# Altium schematic sheet 100046138_block_diagram.SchDoc
size 863 x 558 mm; SheetNumber: 1; SheetTotal: 4
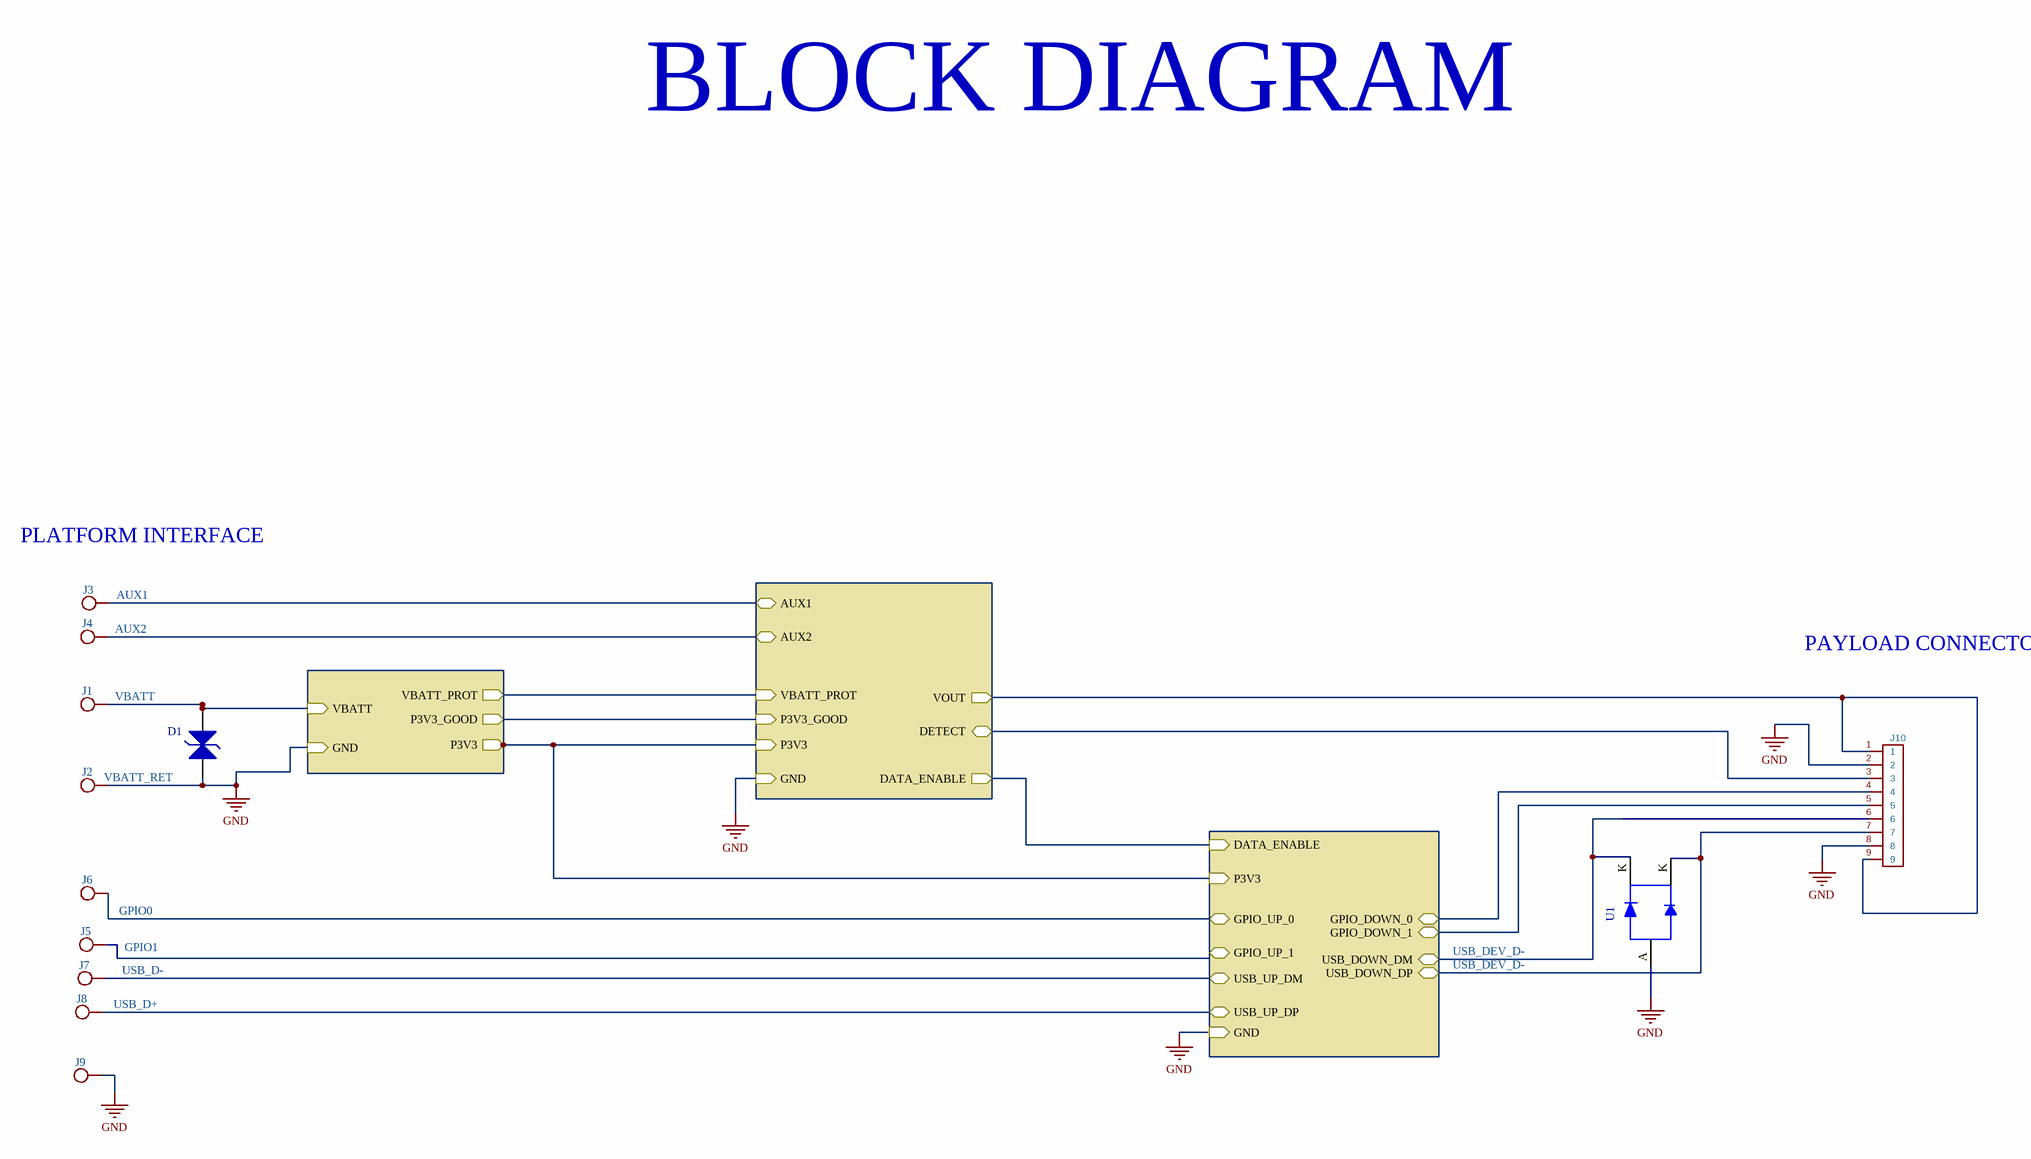
[diagram p0: 100046138_block_diagram.SchDoc]

## Parts
D1  SMF26A  [DI-SOD123F-A]  (value not drawn)
J1  ~  [PTH_18AWG]  (value not drawn)
J2  (no value)  [PTH_18AWG]
J3  (no value)  [PTH_24AWG_offset_rectangular]
J4  (no value)  [PTH_24AWG_offset_rectangular]
J5  (no value)  [PTH_24AWG_offset_rectangular]
J6  ~  [PTH_24AWG_offset_rectangular]  (value not drawn)
J7  ~  [PTH_24AWG_offset_rectangular]  (value not drawn)
J8  ~  [PTH_24AWG_offset_rectangular]  (value not drawn)
J9  ~  [PTH_24AWG_offset_rectangular]  (value not drawn)
J10  ~  [399-10-109-10-007000]  (value not drawn)
U1  PESD5V0C2UM  [IC-SOT883-2-B]  (value not drawn)

## Sub-sheets
Data Switches = 100046138_data_switches.SchDoc: GND (in), P3V3 (in), USB_DOWN_DP (bidir), USB_DOWN_DM (bidir), USB_UP_DP (bidir), USB_UP_DM (bidir), DATA_ENABLE (in), GPIO_DOWN_0 (bidir), GPIO_DOWN_1 (bidir), GPIO_UP_0 (bidir), GPIO_UP_1 (bidir)
Payload Power Control = 100046138_output_control.SchDoc: P3V3 (in), GND (in), VOUT (out), VBATT_PROT (in), AUX1 (bidir), AUX2 (bidir), P3V3_GOOD (in), DETECT (bidir), DATA_ENABLE (out)
Power Input = 100046138_power.SchDoc: VBATT (in), GND (in), P3V3 (out), VBATT_PROT (out), P3V3_GOOD (out)

## Nets
GND: D1.A J2.1 J9.1 J10.2 J10.8 U1.A ; sheet Payload Power Control/GND, sheet Power Input/GND
AUX1: J3.1 ; sheet Payload Power Control/AUX1
AUX2: J4.1 ; sheet Payload Power Control/AUX2
GPIO0: J6.1 ; sheet Data Switches/GPIO_UP_0
USB_D+: J8.1 ; sheet Data Switches/USB_UP_DP
USB_D-: J7.1 ; sheet Data Switches/USB_UP_DM
USB_DEV_D-: J10.6 J10.7 U1.K ; sheet Data Switches/USB_DOWN_DP, sheet Data Switches/USB_DOWN_DM
VBATT: D1.K J1.1 ; sheet Power Input/VBATT
NetJ10_1: J10.1 J10.9 ; sheet Payload Power Control/VOUT
NetJ10_3: J10.3 ; sheet Payload Power Control/DETECT
NetJ10_4: J10.4 ; sheet Data Switches/GPIO_DOWN_0
NetJ10_5: J10.5 ; sheet Data Switches/GPIO_DOWN_1
(unnamed): sheet Data Switches/P3V3, sheet Payload Power Control/P3V3, sheet Power Input/P3V3
(unnamed): sheet Data Switches/DATA_ENABLE, sheet Payload Power Control/DATA_ENABLE
(unnamed): sheet Payload Power Control/VBATT_PROT, sheet Power Input/VBATT_PROT
(unnamed): sheet Payload Power Control/P3V3_GOOD, sheet Power Input/P3V3_GOOD

Not connected (* = marked no-connect by the designer): J5 1

## Notes on the sheet
- BLOCK DIAGRAM
- PLATFORM INTERFACE
- PAYLOAD CONNECTOR
- Labels drawn without touching a wire or pin: GPIO1, VBATT_RET
- DWG NO
- REVISIONS
- SH
- REVISION
- DESCRIPTION
- DATE(YEAR-MO-DA)
- APPROVED
- THIS DRAWING IS CAD MAINTAINED.
  CHANGES SHALL BE INCORPORATED
  BY THE DESIGN ACTIVITY.
- PART NO.
- CONTRACT NUMBER
- DESIGN ACTIVITY
- CONTRACTOR
- US ARMY
  COMBAT CAPABILITIES DEVELOPMENT COMMAND ARMAMENTS CENTER
  PICATINNY ARSENAL, NEW JERSEY 07806-5000
- DRAWN BY
- ENGINEER
- CHECKER
- QUALITY ENGINEER
- DRAWING APPROVAL
- SIZE
- CAGE CODE
- DWG NO.
- NEXT ASSY
- USED ON
- DESIGN APPROVAL
- D
- 19200
- APPLICATION
- SCALE
- NONE
- UNIT WT.
- ---
- SHEET

## Library data of the parts
D1 = CMP-00657-1: SMF Series 200 W 26 V Uni-Directional Surface Mount TVS Diode - SOD-123F; Breakdown Voltage: 30.4V; Clamping Voltage: 42.1V; Max Breakdown Voltage: 31.9V; Max Power Dissipation: 1W; Max Reverse Leakage Current: 1µA; Max Surge Current: 4.8A; Min Breakdown Voltage: 28.9V; Number of Channels: 1; Peak Pulse Power: 1kW; Polarity: Unidirectional; Power Line Protection: No; Reverse Standoff Voltage: 26V; Test Current: 1mA; Footprint: 1a_Littelfuse:SOD-123FL; Composition: Zener; Lead Free: Lead Free; Lifecycle Status: Production; Max Operating Temperature: 150°C; Min Operating Temperature: -65°C; Mounting Technology: Surface Mount; Number of Elements: 1; Number of Terminals: 2; Number of Unidirectional Channels: 1; Packaging: Cut Tape; Peak Pulse Current: 4.8A; Peak Reverse Current: 1µA; REACH SVHC: No; Reverse Voltage: 26V; RoHS: Compliant; Schedule B: 8541100080; Termination: SMD/SMT
J1 J2 = PTH_18AWG: Footprint: 1a_Misc:PTH_18AWG
J3-J9 = PTH_24AWG_offset_rectangle: Footprint: 1a_Misc:PTH_24AWG_offset_rectangular
J10 = 399-10-109-10-007000: Manufacturer: Mill-Max Manufacturing Corp.; MPN: 399-10-109-10-007000; Footprint: 1a_Misc:399-10-109-10-007000
U1 = CMP-00652-2: Extremely low capacitance unidirectional ESD protection diode array; Manufacturer Lifecycle Status: RELEASED FOR SUPPLY; Lifecycle Status: Production